# Altium schematic sheet microcontroller.SchDoc
size A
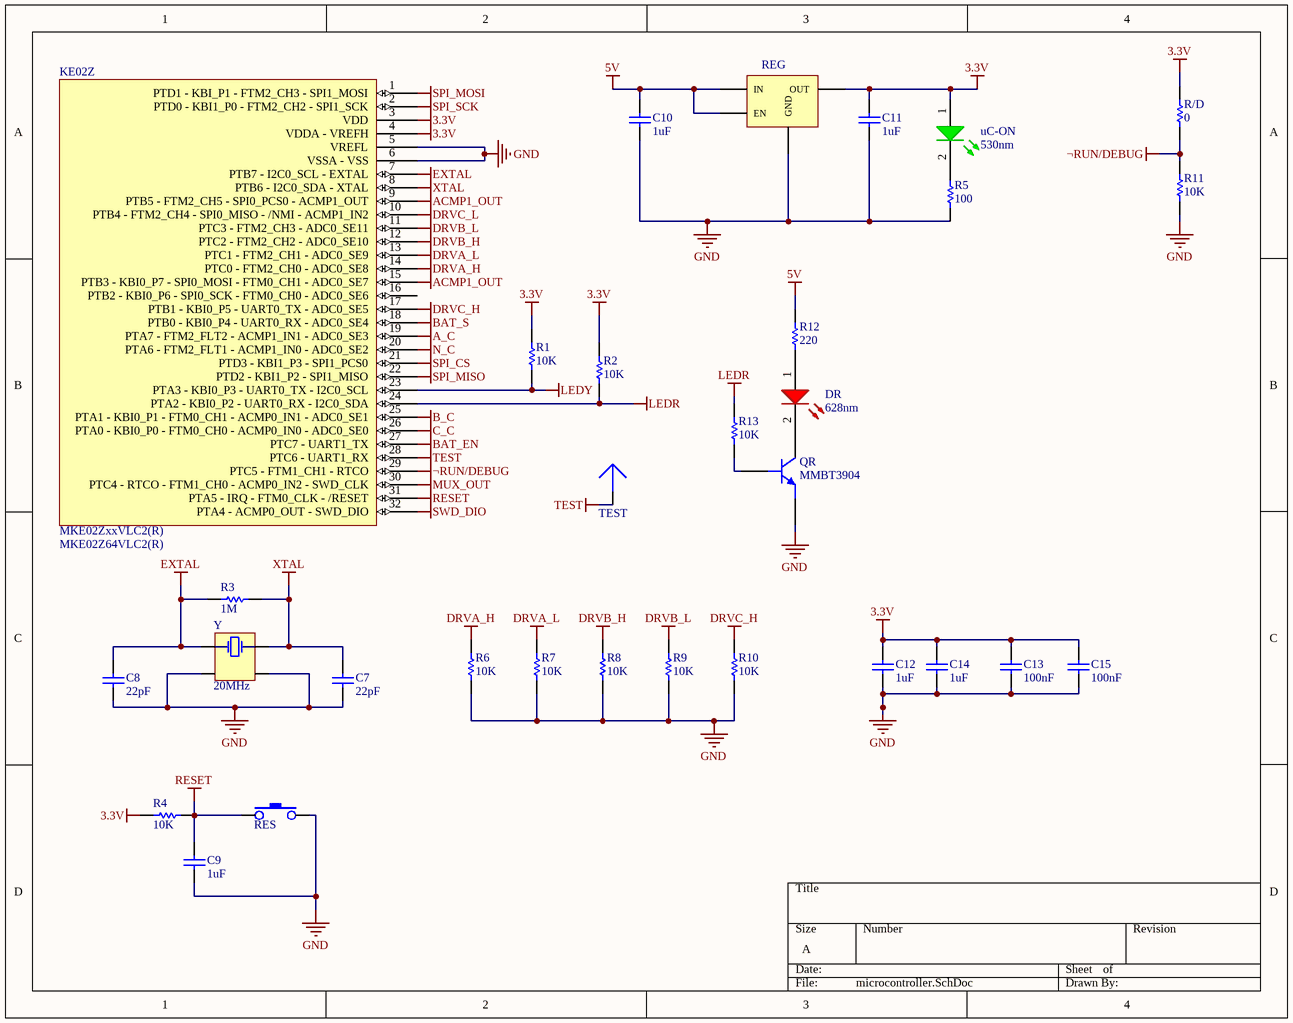
[diagram p0: microcontroller.SchDoc]

## Parts
C7  22pF  [CAPC1608L]
C8  22pF  [CAPC1608L]
C9  1uF  [CAPC1608L]
C10  1uF  [CAPC1608L]
C11  1uF  [CAPC1608L]
C12  1uF  [CAPC1608L]
C13  100nF  [CAPC1608L]
C14  1uF  [CAPC1608L]
C15  100nF  [CAPC1608L]
DR  value 628nm  [DSO-F2/D3.4]  (hidden comment: LED-RED)
KE02Z  MKE02ZxxVLC2(R)  Manufacturer Part Number: MKE02Z64VLC2(R)  [JEDEC_MS-026BBA]
QR  value MMBT3904  [SOT23-3L]  (hidden comment: BJT-NPN-BEC)
R1  10K  [RESC1608L]
R2  10K  [RESC1608L]
R3  1M  [RESC1608L]
R4  10K  [RESC1608L]
R5  100  [RESC1608L]
R6  10K  [RESC1608L]
R7  10K  [RESC1608L]
R8  10K  [RESC1608L]
R9  10K  [RESC1608L]
R10  10K  [RESC1608L]
R11  10K  [RESC1608L]
R12  220  [RESC1608L]
R13  10K  [RESC1608L]
R/D  0  [RESC1608L]
REG  LP5900  [x-TI_S-NGF0006A]  (value not drawn)
RES  SWITCH_TACTILE_SPST-2T-NO  [X-TECO_FSMSM]  (value not drawn)
TEST  TESTPOINT-ARROW-BLUE  [TESTP_PAD_.75mm]  (value not drawn)
uC-ON  value 530nm  [DSO-F2/D3.4]  (hidden comment: LED-GREEN)
Y  20MHz  [X-EPSO_TSX-3225]

## Nets
3.3V: C11.1 C12.1 C13.1 C14.1 C15.1 KE02Z.3(VDD) KE02Z.4(VDDA_-_VREFH) R1.1 R2.1 R4.1 R/D.1 REG.1(OUT) uC-ON.1(A)
5V: C10.1 R12.1 REG.4(EN) REG.6(IN)
A_C: KE02Z.19(PTA7_-_FTM2_FLT2_-_ACMP1_IN1_-_ADC0_SE3)
ACMP1_OUT: KE02Z.9(PTB5_-_FTM2_CH5_-_SPI0_PCS0_-_ACMP1_OUT) KE02Z.15(PTB3_-_KBI0_P7_-_SPI0_MOSI_-_FTM0_CH1_-_ADC0_SE7)
B_C: KE02Z.25(PTA1_-_KBI0_P1_-_FTM0_CH1_-_ACMP0_IN1_-_ADC0_SE1)
BAT_EN: KE02Z.27(PTC7_-_UART1_TX)
BAT_S: KE02Z.18(PTB0_-_KBI0_P4_-_UART0_RX_-_ADC0_SE4)
C_C: KE02Z.26(PTA0_-_KBI0_P0_-_FTM0_CH0_-_ACMP0_IN0_-_ADC0_SE0)
DRVA_H: KE02Z.14(PTC0_-_FTM2_CH0_-_ADC0_SE8) R6.1
DRVA_L: KE02Z.13(PTC1_-_FTM2_CH1_-_ADC0_SE9) R7.1
DRVB_H: KE02Z.12(PTC2_-_FTM2_CH2_-_ADC0_SE10) R8.1
DRVB_L: KE02Z.11(PTC3_-_FTM2_CH3_-_ADC0_SE11) R9.1
DRVC_H: KE02Z.17(PTB1_-_KBI0_P5_-_UART0_TX_-_ADC0_SE5) R10.1
DRVC_L: KE02Z.10(PTB4_-_FTM2_CH4_-_SPI0_MISO_-_/NMI_-_ACMP1_IN2)
EXTAL: C8.1 KE02Z.7(PTB7_-_I2C0_SCL_-_EXTAL) R3.2 Y.1
GND: C7.2 C8.2 C9.2 C10.2 C11.2 C12.2 C13.2 C14.2 C15.2 KE02Z.5(VREFL) KE02Z.6(VSSA_-_VSS) QR.2(E) R5.2 R6.2 R7.2 R8.2 R9.2 R10.2 R11.2 REG.3(GND) RES.2 Y.2 Y.4
LEDR: KE02Z.24(PTA2_-_KBI0_P2_-_UART0_RX_-_I2C0_SDA) R2.2 R13.2
LEDY: KE02Z.23(PTA3_-_KBI0_P3_-_UART0_TX_-_I2C0_SCL) R1.2
MUX_OUT: KE02Z.30(PTC4_-_RTCO_-_FTM1_CH0_-_ACMP0_IN2_-_SWD_CLK)
N_C: KE02Z.20(PTA6_-_FTM2_FLT1_-_ACMP1_IN0_-_ADC0_SE2)
RESET: C9.1 KE02Z.31(PTA5_-_IRQ_-_FTM0_CLK_-_/RESET) R4.2 RES.1
SPI_CS: KE02Z.21(PTD3_-_KBI1_P3_-_SPI1_PCS0)
SPI_MISO: KE02Z.22(PTD2_-_KBI1_P2_-_SPI1_MISO)
SPI_MOSI: KE02Z.1(PTD1_-_KBI_P1_-_FTM2_CH3_-_SPI1_MOSI)
SPI_SCK: KE02Z.2(PTD0_-_KBI1_P0_-_FTM2_CH2_-_SPI1_SCK)
SWD_DIO: KE02Z.32(PTA4_-_ACMP0_OUT_-_SWD_DIO)
TEST: KE02Z.28(PTC6_-_UART1_RX) TEST.1
XTAL: C7.1 KE02Z.8(PTB6_-_I2C0_SDA_-_XTAL) R3.1 Y.3
¬RUN/DEBUG: KE02Z.29(PTC5_-_FTM1_CH1_-_RTCO) R11.1 R/D.2
NetDR_1: DR.1(A) R12.2
NetDR_2: DR.2(K) QR.3(C)
NetQR_1: QR.1(B) R13.1
NetR5_1: R5.1 uC-ON.2(K)

Not connected (* = marked no-connect by the designer): KE02Z 16(PTB2_-_KBI0_P6_-_SPI0_SCK_-_FTM0_CH0_-_ADC0_SE6)

## Library data of the parts
C7 C8 = CAP_22p_0603_50V_NP0_5%: CAP CER 22PF 50V 5% NP0 0603; Manufacturer Part Number: CL10C220JB8NCNC; Name: CAP_22p_0603_50V_NP0_5%; Value: 22pF; Supplier 1: Digi-Key; Supplier Part Number 1: 1276-2227-1-ND
C9-C12 C14 = CAP_1u_0603_25V_X5R_10%: CAP CER 1UF 25V 10% X5R 0603; Manufacturer Part Number: TMK107BJ105KA-T; Name: CAP_1u_0603_25V_X5R_10%; Value: 1uF; Supplier 1: Digi-Key; Supplier Part Number 1: 587-1248-1-ND
C13 C15 = CAP_100n_0603_50V_Y5V: CAP CER 0.1UF 50V Y5V 0603; Manufacturer Part Number: CC0603ZRY5V9BB104; Name: CAP_100n_0603_50V_Y5V; Value: 100nF; Supplier 1: Digi-Key; Supplier Part Number 1: 311-1343-1-ND
DR = LED_RED_0603_628: LED POINTLED 628NM SUPER RED SMD; Manufacturer: OSRAM Opto Semiconductors Inc; Manufacturer Part Number: LS Q971-KN-1; Drawn By: Juan I Carrano; Name: LED_RED_0603_628; Supplier 1: Digi-Key; Supplier Part Number 1: 475-3016-1-ND
KE02Z = MKE02Z64VLC2(R): Kinetis KE02 Cortex®-M0+ MCU 32 Pin LQFP; Manufacturer: Freescale; Name: MKE02Z64VLC2(R)
QR = MMBT3904: TRANSISTOR NPN 40V 0.2A SOT23; Manufacturer: NXP Semiconductors; Name: MMBT3904; Manufacturer Part Number: MMBT3904; Supplier 1: Digi-Key; Supplier Part Number 1: 568-4510-1-ND
R1 R2 R4 R6-R11 R13 = RES_10K_0603_0W1_1%: RES 10K OHM 1/10W 5% 0603; Manufacturer Part Number: RC1608J103CS; Name: RES_10K_0603_0W1_1%; Value: 10K; Supplier 1: Digi-Key; Supplier Part Number 1: 1276-5086-1-ND
R3 = RES_1M_0603_0W1_1%: RES 1.00M OHM 1/10W 1% 0603 SMD; Manufacturer: Yageo; Manufacturer Part Number: RC0603FR-071ML; Name: RES_1M_0603_0W1_1%; Value: 1M; Supplier 1: Digi-Key; Supplier Part Number 1: 311-1.00MHRCT-ND
R5 = RES_100_0603_0W1_1%: RES 100 OHM 1/10W 5% 0603 SMD; Manufacturer Part Number: RC0603JR-07100RL; Name: RES_100_0603_0W1_1%; Value: 100; Supplier 1: Digi-Key; Supplier Part Number 1: 311-100GRCT-ND
R12 = RES_100_0603_0W1_1%: RES 100 OHM 1/10W 5% 0603 SMD; Manufacturer Part Number: RC0603JR-07100RL; Value: 100; Name: RES_100_0603_0W1_1%; Supplier 1: Digi-Key; Supplier Part Number 1: 311-100GRCT-ND
R/D = RES_0_0603_0W1_1%: RES 0.0 OHM 1/10W JUMP 0603; Manufacturer Part Number: RC1608J000CS; Name: RES_0_0603_0W1_1%; Value: 0; Supplier 1: Digi-Key; Supplier Part Number 1: 1276-3510-1-ND
REG = x-TI_LP5900: IC REG LDO 3.3V 0.15A 6WSON; Manufacturer: Texas Instruments; Manufacturer Part Number: LP5900SD-3.3/NOPB; Name: x-TI_LP5900; Supplier 1: Digi-Key; Supplier Part Number 1: LP5900SD-3.3/NOPBCT-ND
RES = SW_TACT_3.5x6mm_SMT: SWITCH TACTILE SPST-NO 0.05A 12V; Manufacturer: TE Connectivity; Manufacturer Part Number: FSMSM; Name: SW_TACT_3.5x6mm_SMT; Supplier 1: Digi-Key; Supplier Part Number 1: 450-1140-ND
TEST = TESTP_PAD_.75mm: Round Test Point on Board; Value: 0.75mm; Name: TESTP_PAD_.75mm
uC-ON = LED_GREEN_0603_530: LED CHIPLED 570NM GREEN 0603 SMD; Manufacturer: OSRAM Opto Semiconductors Inc; Manufacturer Part Number: LG Q971-KN-1; Drawn By: Juan I Carrano; Name: LED_GREEN_0603_530; Supplier 1: Digi-Key; Supplier Part Number 1: 475-1409-1-ND
Y = XTAL_20M_SMD_9p: CRYSTAL 20MHZ 9PF SMD; Manufacturer: EPSON; Manufacturer Part Number: TSX-3225 20.0000MF20G-AC3; Drawn By: Juan I Carrano; Name: XTAL_20M_SMD_9p; Value: 20MHz; Supplier 1: Digi-Key; Supplier Part Number 1: SER3629CT-ND